# Altium schematic sheet Peripherals.SchDoc
size A4; SheetNumber: 3; SheetTotal: 3
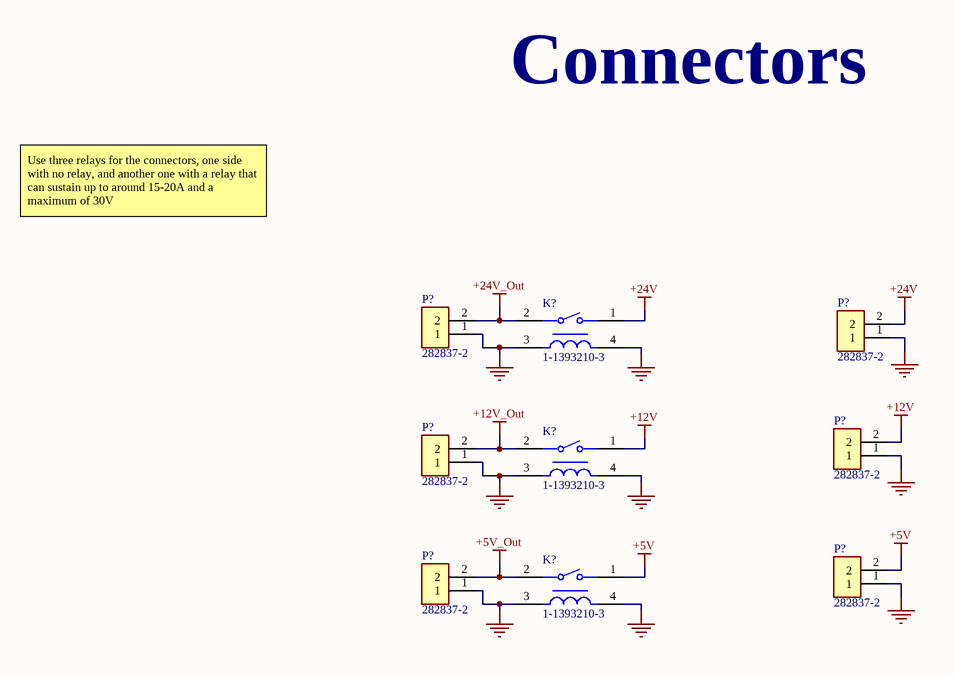
[diagram p0: Peripherals.SchDoc]

## Parts
(Parts that share a designator on the sheet are numbered #1, #2 ... from top to bottom, then left to right.)
K?#1  1-1393210-3  [FP-T9AS1D12-12-MFG]
K?#2  1-1393210-3  [FP-T9AS1D12-12-MFG]
K?#3  1-1393210-3  [FP-T9AS1D12-12-MFG]
P?#1  282837-2  [TE_282837-2]
P?#2  282837-2  [TE_282837-2]
P?#3  282837-2  [TE_282837-2]
P?#4  282837-2  [TE_282837-2]
P?#5  282837-2  [TE_282837-2]
P?#6  282837-2  [TE_282837-2]

## Nets
+5V: K?#3.1 P?#5.2
+5V_Out: K?#3.2 P?#6.2
+12V: K?#2.1 P?#3.2
+12V_Out: K?#2.2 P?#4.2
+24V: K?#1.1 P?#2.2
+24V_Out: K?#1.2 P?#1.2
GND: K?#1.3 K?#1.4 K?#2.3 K?#2.4 K?#3.3 K?#3.4 P?#1.1 P?#2.1 P?#3.1 P?#4.1 P?#5.1 P?#6.1

## Notes on the sheet
- Connectors
- Use three relays for the connectors, one side with no relay, and another one with a relay that can sustain up to around 15-20A and a maximum of 30V

## Library data of the parts
K?#1-K?#3 = CMP-03790-41173529-2: 1-1393210-3 Electromechanical Relay 12VDC 144Ohm 30A SPST-NO (32.51x27.43x20.4)mm THT Industrial Relay; Manufacturer Package Identifier: T9AS1D12-12; Manufacturer Lifecycle Status: ACTIVE; Coil Voltage (DC): 12V; Number of Contacts: 1; Operate Time: 15ms; Throw Configuration: SPST; Coil Type: Non-Latching; Ratings: IP67; Voltage Rating (AC): 277V; Switching Capacity: 1.6kW; Coil Power: 1W; Coil Resistance: 144Ω; Contact Resistance: 75mΩ; Coil Current: 83mA; Switching Current: 30A; RoHS: Compliant; Lead Free: Lead Free; Contact Material: Cadmium, Silver; Max Operating Temperature: 85°C; Radiation Hardening: No; Height: 20.4mm; Ambient Temperature Range High: 85°C; Termination: PC Pin; Depth: 27.43mm; Number of Pins: 4; Width: 27.4mm; Lifecycle Status: Production; Mount: Through Hole; Max Current Rating: 30A; Current Rating: 30A; Coil Voltage (AC): 12V; ELV: Non-Compliant; NexarPartId: 41173529; Min Operating Temperature: -55°C; Voltage Rating (DC): 12V; Max Voltage Rating (AC): 277V; Length: 32.51mm; Power Consumption: 1W; Contact Current Rating: 30A; REACH SVHC: Unknown
P?#1-P?#6 = CMP-161-000000-2: 6 Position Wire to Board Conector; MF: TE Connectivity; MP: 282837-2; Pin Count: 2; Purchase-URL: https://pricing.snapeda.com/search/part/282837-2/?ref=eda; SnapEDA_Link: https://www.snapeda.com/parts/282837-2/TE+Connectivity+AMP+Connectors/view-part/?ref=snap; Value: *; Availability: In Stock; Component Type: Standard; Package: None; Check_prices: https://www.snapeda.com/parts/282837-2/TE+Connectivity+AMP+Connectors/view-part/?ref=eda; Price: None; Design Item ID: 282837-2; Source: 282837-2.SchLib